# Altium schematic sheet VoltageSupply.SchDoc
size 297 x 209 mm
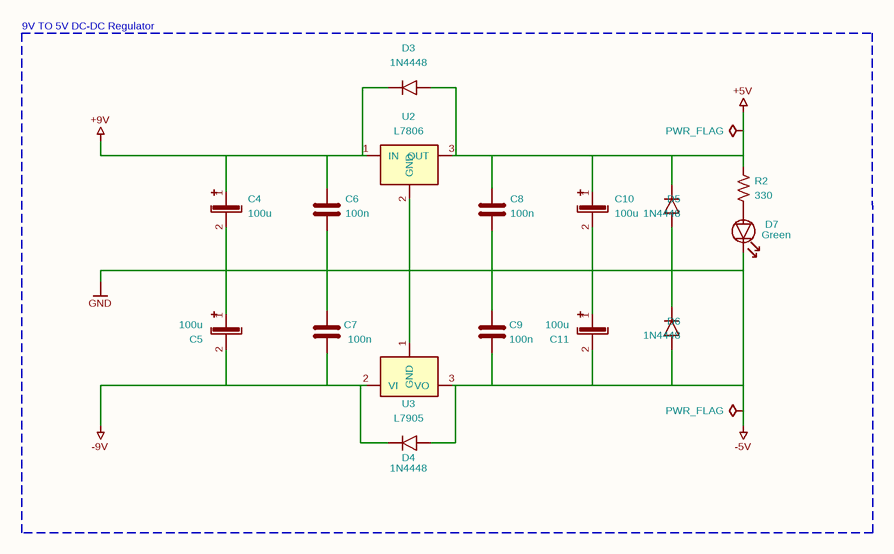
[diagram p0: VoltageSupply.SchDoc]

## Parts
#FLG01  PWR_FLAG  (graphical)
#FLG02  PWR_FLAG  (graphical)
C4  100u  [C_1210_3225Metric]
C5  100u  [C_1210_3225Metric]
C6  100n  [C_1210_3225Metric]
C7  100n  [C_1210_3225Metric]
C8  100n  [C_1210_3225Metric]
C9  100n  [C_1210_3225Metric]
C10  100u  [C_1206_3216Metric]
C11  100u  [C_1206_3216Metric]
D3  1N4448  [D_DO-35_SOD27_P7.62mm_Horizontal]
D4  1N4448  [D_DO-35_SOD27_P7.62mm_Horizontal]
D5  1N4448  [D_DO-35_SOD27_P7.62mm_Horizontal]
D6  1N4448  [D_DO-35_SOD27_P7.62mm_Horizontal]
D7  Green  [LED_D5.0mm_Horizontal_O6.35mm_Z15.0mm]
R2  330  [R_1206_3216Metric]
U2  L7806  [TO-220-3_Horizontal_TabDown]
U3  L7905  [TO-220-3_Horizontal_TabDown]

## Blocks framed on the sheet
9V TO 5V DC-DC Regulator /: #FLG01 #FLG02 C4-C11 D3-D7 R2 U2 U3

## Nets
+5V: #FLG01.1(pwr) C8.1 C10.1 D3.2(A) D5.1(K) R2.1 U2.3(OUT)
+9V: C4.1 C6.1 D3.1(K) U2.1(IN)
-5V: #FLG02.1(pwr) C4.2 C5.1 C6.2 C7.2 C8.2 C9.1 C9.2 C10.2 C11.1 C11.2 D4.2(A) D5.2(A) D6.1(K) D6.2(A) D7.1(K) U2.2(GND) U3.1(GND) U3.3(VO)  [also labelled GND]
-9V: C5.2 C7.1 D4.1(K) U3.2(VI)
NetD7_2: D7.2(A) R2.2

## Notes on the sheet
- 1
- 2
- 3
- 4
- 5
- 6
- A
- B
- C
- Bipolarno napajanje za 5V
- D
- Title: Uređaj za merenje efektivne vrednosti AC napona
- File: VoltageSupply.kicad_sch
- Sheet: /
- Srđan Milkić
- KiCad E.D.A.  kicad (5.1.4)-1
- Size: A4
- Date: 2024-01-19
- Rev: 2
- Id: 1/1

## Library data of the parts
C4 C5 = Cap_pol: Value: 100u; Footprint: Capacitor_SMD:C_1210_3225Metric
C6-C9 = C: Value: 100n; Footprint: Capacitor_SMD:C_1210_3225Metric
C10 = Cap_pol_2: Value: 100u; Footprint: Capacitor_SMD:C_1206_3216Metric
C11 = Cap_pol_1: Value: 100u; Footprint: Capacitor_SMD:C_1206_3216Metric
D7 = LED: Value: Green; Footprint: LED_THT:LED_D5.0mm_Horizontal_O6.35mm_Z15.0mm
R2 = R_US: Value: 330; Footprint: Resistor_SMD:R_1206_3216Metric
#FLG01 #FLG02 = PWR_FLAG: Value: PWR_FLAG
D3-D6 = 1N4448: Value: 1N4448; Footprint: Diode_THT:D_DO-35_SOD27_P7.62mm_Horizontal
U2 = L7806: Value: L7806; Footprint: Package_TO_SOT_THT:TO-220-3_Horizontal_TabDown
U3 = L7905: Value: L7905; Footprint: Package_TO_SOT_THT:TO-220-3_Horizontal_TabDown